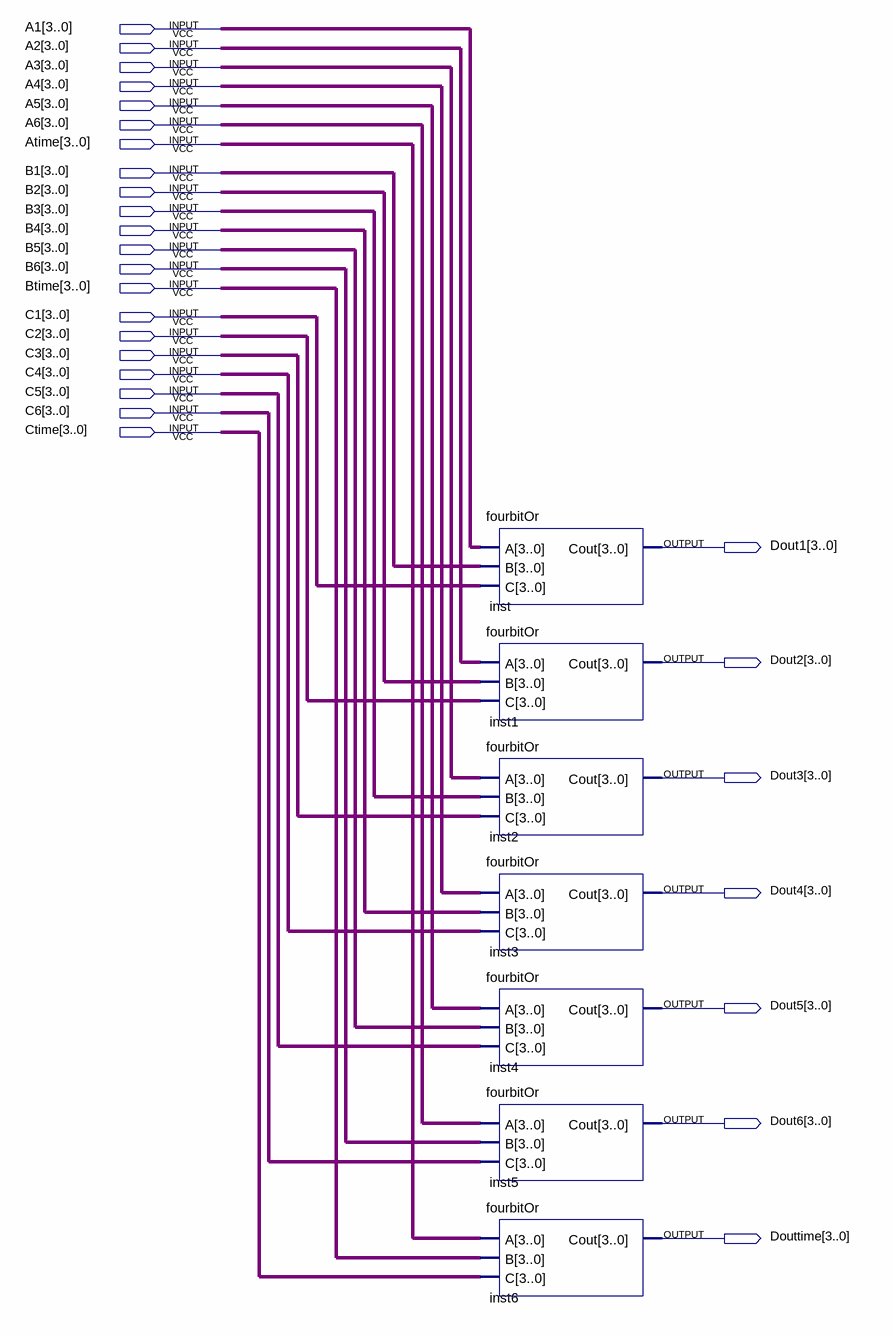
[diagram p0: schematic sheet]
// Quartus schematic sixOr.bdf as structural Verilog: 7 symbols, 28 pins
module sixOr (
  input  [3:0] A1,
  input  [3:0] A2,
  input  [3:0] A3,
  input  [3:0] A4,
  input  [3:0] A5,
  input  [3:0] A6,
  input  [3:0] Atime,
  input  [3:0] B1,
  input  [3:0] B2,
  input  [3:0] B3,
  input  [3:0] B4,
  input  [3:0] B5,
  input  [3:0] B6,
  input  [3:0] Btime,
  input  [3:0] C1,
  input  [3:0] C2,
  input  [3:0] C3,
  input  [3:0] C4,
  input  [3:0] C5,
  input  [3:0] C6,
  input  [3:0] Ctime,
  output [3:0] Dout1,
  output [3:0] Dout2,
  output [3:0] Dout3,
  output [3:0] Dout4,
  output [3:0] Dout5,
  output [3:0] Dout6,
  output [3:0] Douttime
);

  fourbitOr inst (.A(A1), .B(B1), .C(C1), .Cout(Dout1));
  fourbitOr inst1 (.A(A2), .B(B2), .C(C2), .Cout(Dout2));
  fourbitOr inst2 (.A(A3), .B(B3), .C(C3), .Cout(Dout3));
  fourbitOr inst3 (.A(A4), .B(B4), .C(C4), .Cout(Dout4));
  fourbitOr inst4 (.A(A5), .B(B5), .C(C5), .Cout(Dout5));
  fourbitOr inst5 (.A(A6), .B(B6), .C(C6), .Cout(Dout6));
  fourbitOr inst6 (.A(Atime), .B(Btime), .C(Ctime), .Cout(Douttime));
endmodule
